# Altium schematic sheet LED_Orange_Direct.SchDoc
size A4; SheetNumber: 10; SheetTotal: 29
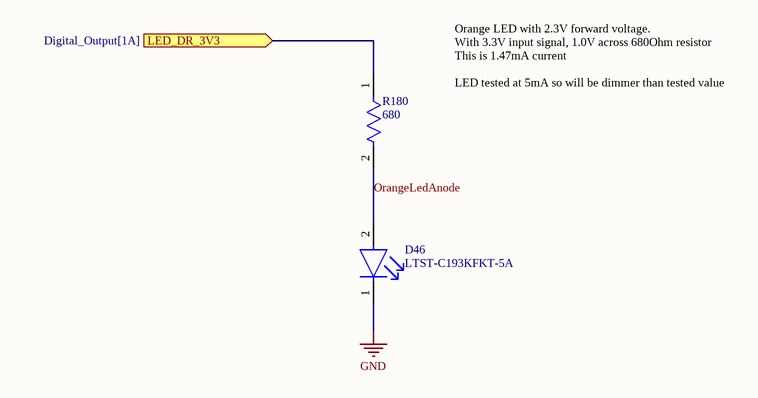
[diagram p0: LED_Orange_Direct.SchDoc]

## Parts
D46  LTST-C193KFKT-5A  [FP-LTST-C193KGKT-5A-MFG]
R180  value 680  [FP-CRCW0603-e3-IPC_C]  (hidden comment: CRCW0603680RJNEA)

## Ports
LED_DR_3V3 (in, see Digital_Output[1A])

## Nets
GND: D46.1(C)
LED_DR_3V3: R180.1 ; port LED_DR_3V3
OrangeLedAnode: D46.2(A) R180.2

## Notes on the sheet
- Orange LED with 2.3V forward voltage.
  With 3.3V input signal, 1.0V across 680Ohm resistor
  This is 1.47mA current
  LED tested at 5mA so will be dimmer than tested value

## Library data of the parts
D46 = CMP-007-00037-1: LED orange LED0603 wavelength 605nm light intensity 11~45mcd vertical sticker; Lens Color: Clear, Colorless; Number of LEDs: 1; Lens Transparency: Clear; Test Current: 5mA; Lens Style: Colorless, Diffused, Rectangular; Shape: Rectangular; Peak Wavelength: 611nm; Luminous Intensity: 28.1mcd; Forward Current: 30mA; Power Rating: 75mW; Illumination Color: Yellow; Viewing Angle: 130°; Forward Voltage: 2.3V; Reverse Voltage: 5V; Width: 800µm; Number of Circuits: 1; Case Code (Metric): 1608; Height: 350µm; Terminal Pitch: 1.5mm; Lifecycle Status: Production; Case/Package: 0603; Contact Plating: Tin; Number of Terminals: 2; Wavelength: 605nm; REACH SVHC: Yes; RoHS: Compliant; Introduction Date: 2010-10-11; Pins: 2; Packaging: Tape and Reel; Color: Orange; Radiation Hardening: No; Schedule B: 8541402000, 8541402000; Max Operating Temperature: 85°C; Number of Elements: 1; Length: 1.6mm; Power Dissipation: 75mW; Mounting Technology: Surface Mount; Harmonized Tariff Schedule (HTS) Code: 8541.40.20.00; Dominant Wavelength: 605nm; Case Code (Imperial): 0603; Depth: 800µm; China RoHS: Compliant; Min Operating Temperature: -30°C
R180 = CMP-009-00300-1: Fixed Resistor, Metal Glaze/Thick Film, 0.1W, 680ohm, 75V, 5% +/-Tol, Surface Mount, 0603; Power Rating: 100mW; Temperature Coefficient: 200ppm/°C; Case/Package: 0603; Voltage Rating (DC): 75V; Lifecycle Status: Production; Depth: 850µm; Introduction Date: 2005-02-16; Number of Terminations: 2; Composition: Thick Film; Export Control Classification Number (ECCN) Code: EAR99; RoHS: Compliant; Packaging: Cut Tape; Max Power Dissipation: 100mW; Max Operating Temperature: 155°C; Harmonized Tariff Schedule (HTS) Code: 8533.21.00.30; Voltage Rating: 75V; China RoHS: Non-Compliant; Width: 850µm; Height: 450µm; Schedule B: 8533210045, 8533210045; Mounting Technology: Surface Mount; Pins: 2; Radiation Hardening: No; Features: Automotive AEC-Q200; Min Operating Temperature: -55°C; Lead Free: Lead Free; Working Voltage: 75V; Military Standard: Not; Tolerance: 5%; Case Code (Imperial): 0603; Number of Terminals: 2; Weight: 2.012816mg; REACH SVHC: Yes; Length: 1.55mm; Ratings: AEC-Q200; Contact Plating: Tin; Termination: SMD/SMT; Country of Origin: Israel, Taiwan